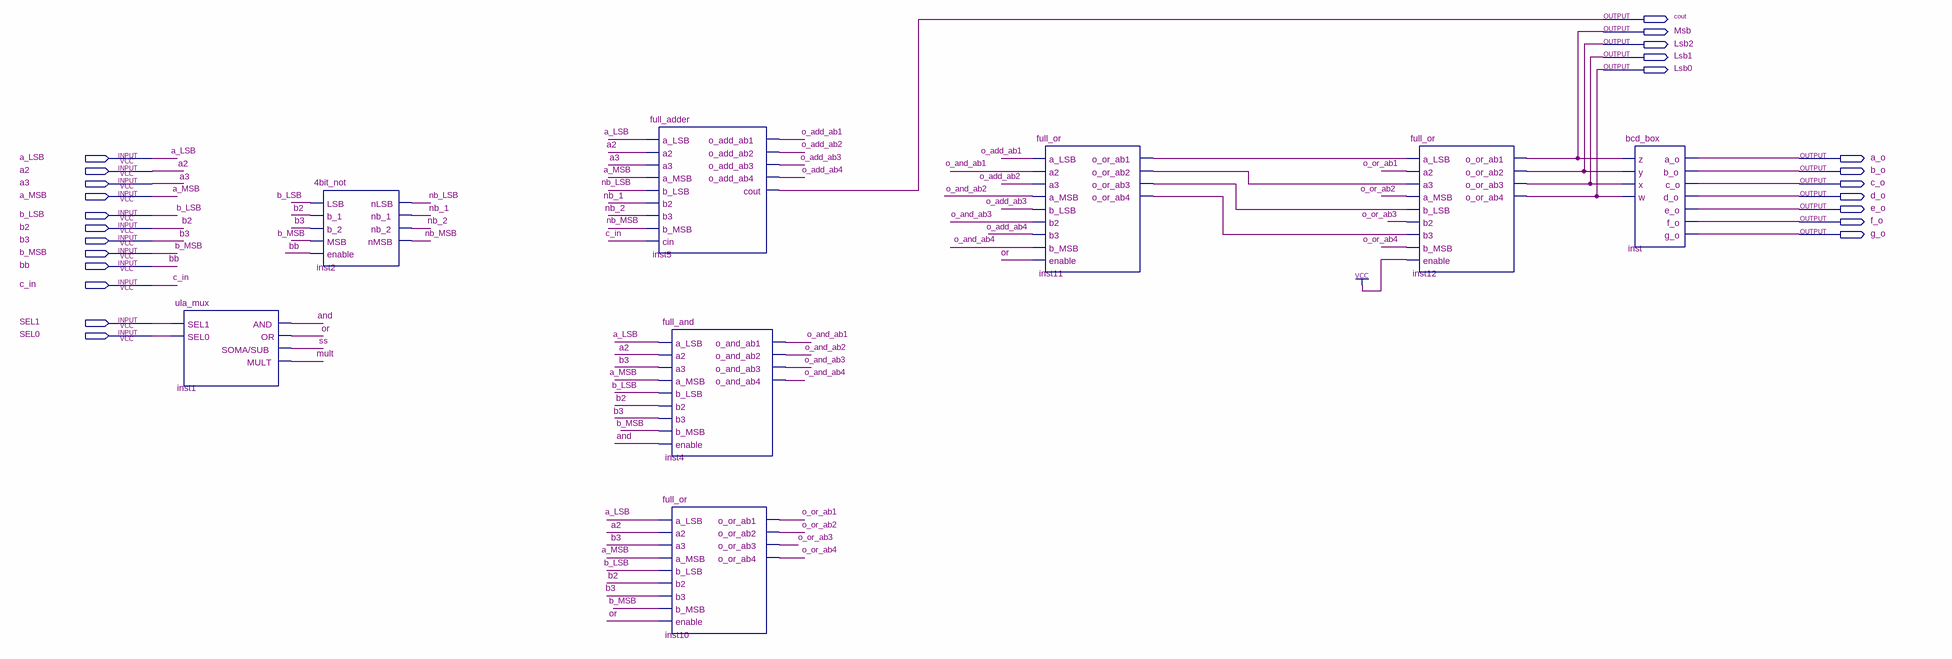
[diagram p0: schematic sheet]
// Quartus schematic ula.bdf as structural Verilog: 8 symbols, 24 pins
module ula (
  input  a_LSB,
  input  a2,
  input  a3,
  input  a_MSB,
  input  b_LSB,
  input  b2,
  input  b3,
  input  b_MSB,
  input  bb,
  input  c_in,
  input  SEL1,
  input  SEL0,
  output cout,
  output Msb,
  output Lsb2,
  output Lsb1,
  output Lsb0,
  output a_o,
  output b_o,
  output c_o,
  output d_o,
  output e_o,
  output f_o,
  output g_o
);

  wire \and , inst11_o_or_ab1, inst11_o_or_ab2, inst11_o_or_ab3, inst11_o_or_ab4, mult, nb_1, nb_2, nb_LSB,
       nb_MSB, o_add_ab1, o_add_ab2, o_add_ab3, o_add_ab4, o_and_ab1, o_and_ab2, o_and_ab3, o_and_ab4,
       o_or_ab1, o_or_ab2, o_or_ab3, o_or_ab4, \or , ss;

  ula_mux inst1 (.SEL1(SEL1), .SEL0(SEL0), .AND(\and ), .OR(\or ), .\SOMA/SUB (ss), .MULT(mult));
  \4bit_not  inst2 (
    .LSB(b_LSB), .b_1(b2), .b_2(b3), .MSB(b_MSB), .enable(bb), .nLSB(nb_LSB), .nb_1(nb_1), .nb_2(nb_2),
    .nMSB(nb_MSB));
  full_adder inst5 (
    .a_LSB(a_LSB), .a2(a2), .a3(a3), .a_MSB(a_MSB), .b_LSB(nb_LSB), .b2(nb_1), .b3(nb_2), .b_MSB(nb_MSB),
    .cin(c_in), .o_add_ab1(o_add_ab1), .o_add_ab2(o_add_ab2), .o_add_ab3(o_add_ab3), .o_add_ab4(o_add_ab4),
    .cout(cout));
  full_and inst4 (
    .a_LSB(a_LSB), .a2(a2), .a3(b3), .a_MSB(a_MSB), .b_LSB(b_LSB), .b2(b2), .b3(b3), .b_MSB(b_MSB),
    .enable(\and ), .o_and_ab1(o_and_ab1), .o_and_ab2(o_and_ab2), .o_and_ab3(o_and_ab3), .o_and_ab4(o_and_ab4));
  full_or inst10 (
    .a_LSB(a_LSB), .a2(a2), .a3(b3), .a_MSB(a_MSB), .b_LSB(b_LSB), .b2(b2), .b3(b3), .b_MSB(b_MSB),
    .enable(\or ), .o_or_ab1(o_or_ab1), .o_or_ab2(o_or_ab2), .o_or_ab3(o_or_ab3), .o_or_ab4(o_or_ab4));
  full_or inst11 (
    .a_LSB(o_add_ab1), .a2(o_and_ab1), .a3(o_add_ab2), .a_MSB(o_and_ab2), .b_LSB(o_add_ab3), .b2(o_and_ab3),
    .b3(o_add_ab4), .b_MSB(o_and_ab4), .enable(\or ), .o_or_ab1(inst11_o_or_ab1), .o_or_ab2(inst11_o_or_ab2),
    .o_or_ab3(inst11_o_or_ab3), .o_or_ab4(inst11_o_or_ab4));
  full_or inst12 (
    .a_LSB(inst11_o_or_ab1), .a2(o_or_ab1), .a3(inst11_o_or_ab2), .a_MSB(o_or_ab2), .b_LSB(inst11_o_or_ab3),
    .b2(o_or_ab3), .b3(inst11_o_or_ab4), .b_MSB(o_or_ab4), .enable(1'b1), .o_or_ab1(Msb), .o_or_ab2(Lsb2),
    .o_or_ab3(Lsb1), .o_or_ab4(Lsb0));
  bcd_box inst (
    .z(Msb), .y(Lsb2), .x(Lsb1), .w(Lsb0), .a_o(a_o), .b_o(b_o), .c_o(c_o), .d_o(d_o), .e_o(e_o), .f_o(f_o),
    .g_o(g_o));
endmodule
